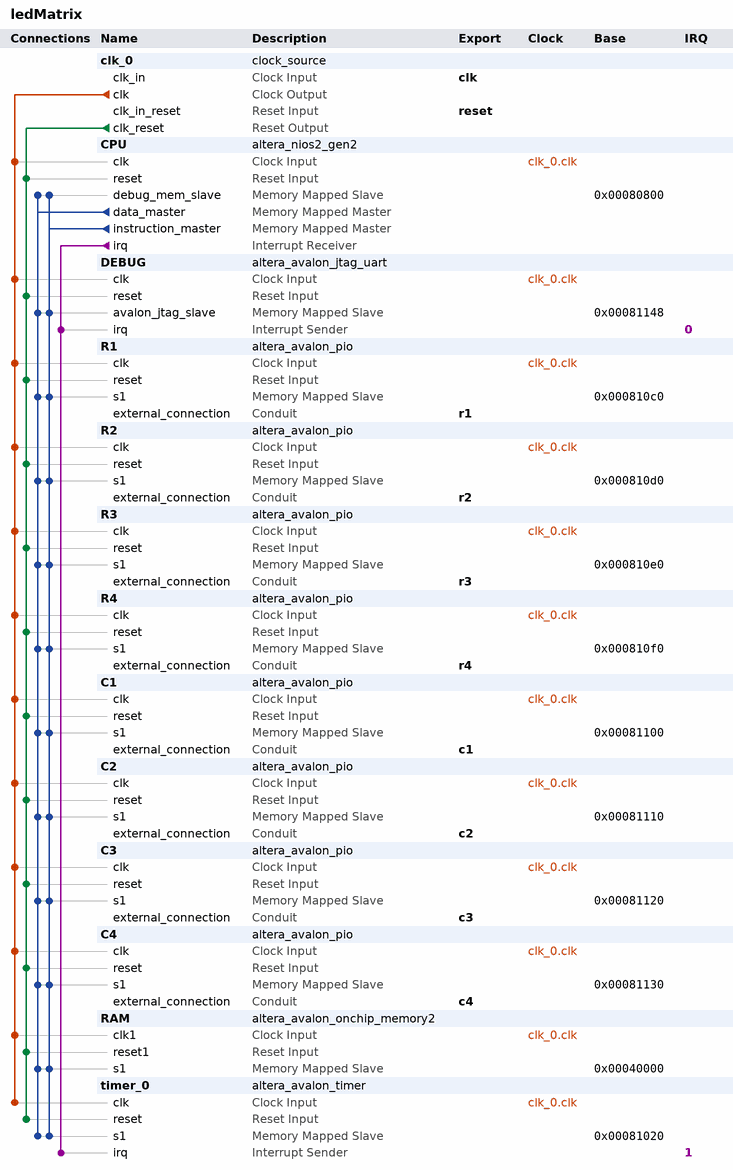
[diagram p0: system contents]
# Platform Designer (Qsys) system ledMatrix, Cyclone IV E EP4CE115F29C7
# Parameters at their usual value, and those the tool derives, are not listed.
package require -exact qsys 17.1
create_system ledMatrix
set_project_property DEVICE_FAMILY {Cyclone IV E}
set_project_property DEVICE EP4CE115F29C7

add_instance clk_0 clock_source 17.1
set_instance_parameter_value clk_0 clockFrequency 50000000

add_instance CPU altera_nios2_gen2 17.1
set_instance_parameter_value CPU dcache_size 2048
set_instance_parameter_value CPU exceptionSlave RAM.s1
set_instance_parameter_value CPU icache_size 4096
set_instance_parameter_value CPU impl Tiny
set_instance_parameter_value CPU resetSlave RAM.s1

add_instance DEBUG altera_avalon_jtag_uart 17.1
set_instance_parameter_value DEBUG simInteractiveOptions NO_INTERACTIVE_WINDOWS

add_instance R1 altera_avalon_pio 17.1
set_instance_parameter_value R1 direction Output
set_instance_parameter_value R1 width 1

add_instance R2 altera_avalon_pio 17.1
set_instance_parameter_value R2 direction Output
set_instance_parameter_value R2 width 1

add_instance R3 altera_avalon_pio 17.1
set_instance_parameter_value R3 direction Output
set_instance_parameter_value R3 width 1

add_instance R4 altera_avalon_pio 17.1
set_instance_parameter_value R4 direction Output
set_instance_parameter_value R4 width 1

add_instance C1 altera_avalon_pio 17.1
set_instance_parameter_value C1 direction Input
set_instance_parameter_value C1 width 1

add_instance C2 altera_avalon_pio 17.1
set_instance_parameter_value C2 direction Input
set_instance_parameter_value C2 width 1

add_instance C3 altera_avalon_pio 17.1
set_instance_parameter_value C3 direction Input
set_instance_parameter_value C3 width 1

add_instance C4 altera_avalon_pio 17.1
set_instance_parameter_value C4 direction Input
set_instance_parameter_value C4 width 1

add_instance RAM altera_avalon_onchip_memory2 17.1
set_instance_parameter_value RAM dataWidth 32
set_instance_parameter_value RAM dualPort false
set_instance_parameter_value RAM initMemContent true
set_instance_parameter_value RAM initializationFileName onchip_mem.hex
set_instance_parameter_value RAM memorySize 204800

add_instance timer_0 altera_avalon_timer 17.1
set_instance_parameter_value timer_0 period 1
set_instance_parameter_value timer_0 periodUnits MSEC

# connections
add_connection clk_0.clk C1.clk clock
add_connection clk_0.clk C2.clk clock
add_connection clk_0.clk C3.clk clock
add_connection clk_0.clk C4.clk clock
add_connection clk_0.clk CPU.clk clock
add_connection clk_0.clk DEBUG.clk clock
add_connection clk_0.clk R1.clk clock
add_connection clk_0.clk R2.clk clock
add_connection clk_0.clk R3.clk clock
add_connection clk_0.clk R4.clk clock
add_connection clk_0.clk RAM.clk1 clock
add_connection clk_0.clk timer_0.clk clock
add_connection clk_0.clk_reset C1.reset reset
add_connection clk_0.clk_reset C2.reset reset
add_connection clk_0.clk_reset C3.reset reset
add_connection clk_0.clk_reset C4.reset reset
add_connection clk_0.clk_reset CPU.reset reset
add_connection clk_0.clk_reset DEBUG.reset reset
add_connection clk_0.clk_reset R1.reset reset
add_connection clk_0.clk_reset R2.reset reset
add_connection clk_0.clk_reset R3.reset reset
add_connection clk_0.clk_reset R4.reset reset
add_connection clk_0.clk_reset RAM.reset1 reset
add_connection clk_0.clk_reset timer_0.reset reset
add_connection CPU.data_master C1.s1 avalon
set_connection_parameter_value CPU.data_master/C1.s1 baseAddress 0x00081100
add_connection CPU.data_master C2.s1 avalon
set_connection_parameter_value CPU.data_master/C2.s1 baseAddress 0x00081110
add_connection CPU.data_master C3.s1 avalon
set_connection_parameter_value CPU.data_master/C3.s1 baseAddress 0x00081120
add_connection CPU.data_master C4.s1 avalon
set_connection_parameter_value CPU.data_master/C4.s1 baseAddress 0x00081130
add_connection CPU.data_master CPU.debug_mem_slave avalon
set_connection_parameter_value CPU.data_master/CPU.debug_mem_slave baseAddress 0x00080800
add_connection CPU.data_master DEBUG.avalon_jtag_slave avalon
set_connection_parameter_value CPU.data_master/DEBUG.avalon_jtag_slave baseAddress 0x00081148
add_connection CPU.data_master R1.s1 avalon
set_connection_parameter_value CPU.data_master/R1.s1 baseAddress 0x000810c0
add_connection CPU.data_master R2.s1 avalon
set_connection_parameter_value CPU.data_master/R2.s1 baseAddress 0x000810d0
add_connection CPU.data_master R3.s1 avalon
set_connection_parameter_value CPU.data_master/R3.s1 baseAddress 0x000810e0
add_connection CPU.data_master R4.s1 avalon
set_connection_parameter_value CPU.data_master/R4.s1 baseAddress 0x000810f0
add_connection CPU.data_master RAM.s1 avalon
set_connection_parameter_value CPU.data_master/RAM.s1 baseAddress 0x00040000
add_connection CPU.data_master timer_0.s1 avalon
set_connection_parameter_value CPU.data_master/timer_0.s1 baseAddress 0x00081020
add_connection CPU.instruction_master C1.s1 avalon
set_connection_parameter_value CPU.instruction_master/C1.s1 baseAddress 0x00081100
add_connection CPU.instruction_master C2.s1 avalon
set_connection_parameter_value CPU.instruction_master/C2.s1 baseAddress 0x00081110
add_connection CPU.instruction_master C3.s1 avalon
set_connection_parameter_value CPU.instruction_master/C3.s1 baseAddress 0x00081120
add_connection CPU.instruction_master C4.s1 avalon
set_connection_parameter_value CPU.instruction_master/C4.s1 baseAddress 0x00081130
add_connection CPU.instruction_master CPU.debug_mem_slave avalon
set_connection_parameter_value CPU.instruction_master/CPU.debug_mem_slave baseAddress 0x00080800
add_connection CPU.instruction_master DEBUG.avalon_jtag_slave avalon
set_connection_parameter_value CPU.instruction_master/DEBUG.avalon_jtag_slave baseAddress 0x00081148
add_connection CPU.instruction_master R1.s1 avalon
set_connection_parameter_value CPU.instruction_master/R1.s1 baseAddress 0x000810c0
add_connection CPU.instruction_master R2.s1 avalon
set_connection_parameter_value CPU.instruction_master/R2.s1 baseAddress 0x000810d0
add_connection CPU.instruction_master R3.s1 avalon
set_connection_parameter_value CPU.instruction_master/R3.s1 baseAddress 0x000810e0
add_connection CPU.instruction_master R4.s1 avalon
set_connection_parameter_value CPU.instruction_master/R4.s1 baseAddress 0x000810f0
add_connection CPU.instruction_master RAM.s1 avalon
set_connection_parameter_value CPU.instruction_master/RAM.s1 baseAddress 0x00040000
add_connection CPU.instruction_master timer_0.s1 avalon
set_connection_parameter_value CPU.instruction_master/timer_0.s1 baseAddress 0x00081020
add_connection CPU.irq DEBUG.irq interrupt
set_connection_parameter_value CPU.irq/DEBUG.irq irqNumber 0
add_connection CPU.irq timer_0.irq interrupt
set_connection_parameter_value CPU.irq/timer_0.irq irqNumber 1

# exported interfaces
add_interface c1 conduit end
set_interface_property c1 EXPORT_OF C1.external_connection
add_interface c2 conduit end
set_interface_property c2 EXPORT_OF C2.external_connection
add_interface c3 conduit end
set_interface_property c3 EXPORT_OF C3.external_connection
add_interface c4 conduit end
set_interface_property c4 EXPORT_OF C4.external_connection
add_interface clk clock sink
set_interface_property clk EXPORT_OF clk_0.clk_in
add_interface r1 conduit end
set_interface_property r1 EXPORT_OF R1.external_connection
add_interface r2 conduit end
set_interface_property r2 EXPORT_OF R2.external_connection
add_interface r3 conduit end
set_interface_property r3 EXPORT_OF R3.external_connection
add_interface r4 conduit end
set_interface_property r4 EXPORT_OF R4.external_connection
add_interface reset reset sink
set_interface_property reset EXPORT_OF clk_0.clk_in_reset

set_interconnect_requirement {$system} qsys_mm.clockCrossingAdapter HANDSHAKE
set_interconnect_requirement {$system} qsys_mm.enableEccProtection FALSE
set_interconnect_requirement {$system} qsys_mm.insertDefaultSlave FALSE
set_interconnect_requirement {$system} qsys_mm.maxAdditionalLatency 1

save_system ledMatrix.qsys
